# EAGLE design avr-net-pcb-rev.A (EAGLE 5.10)
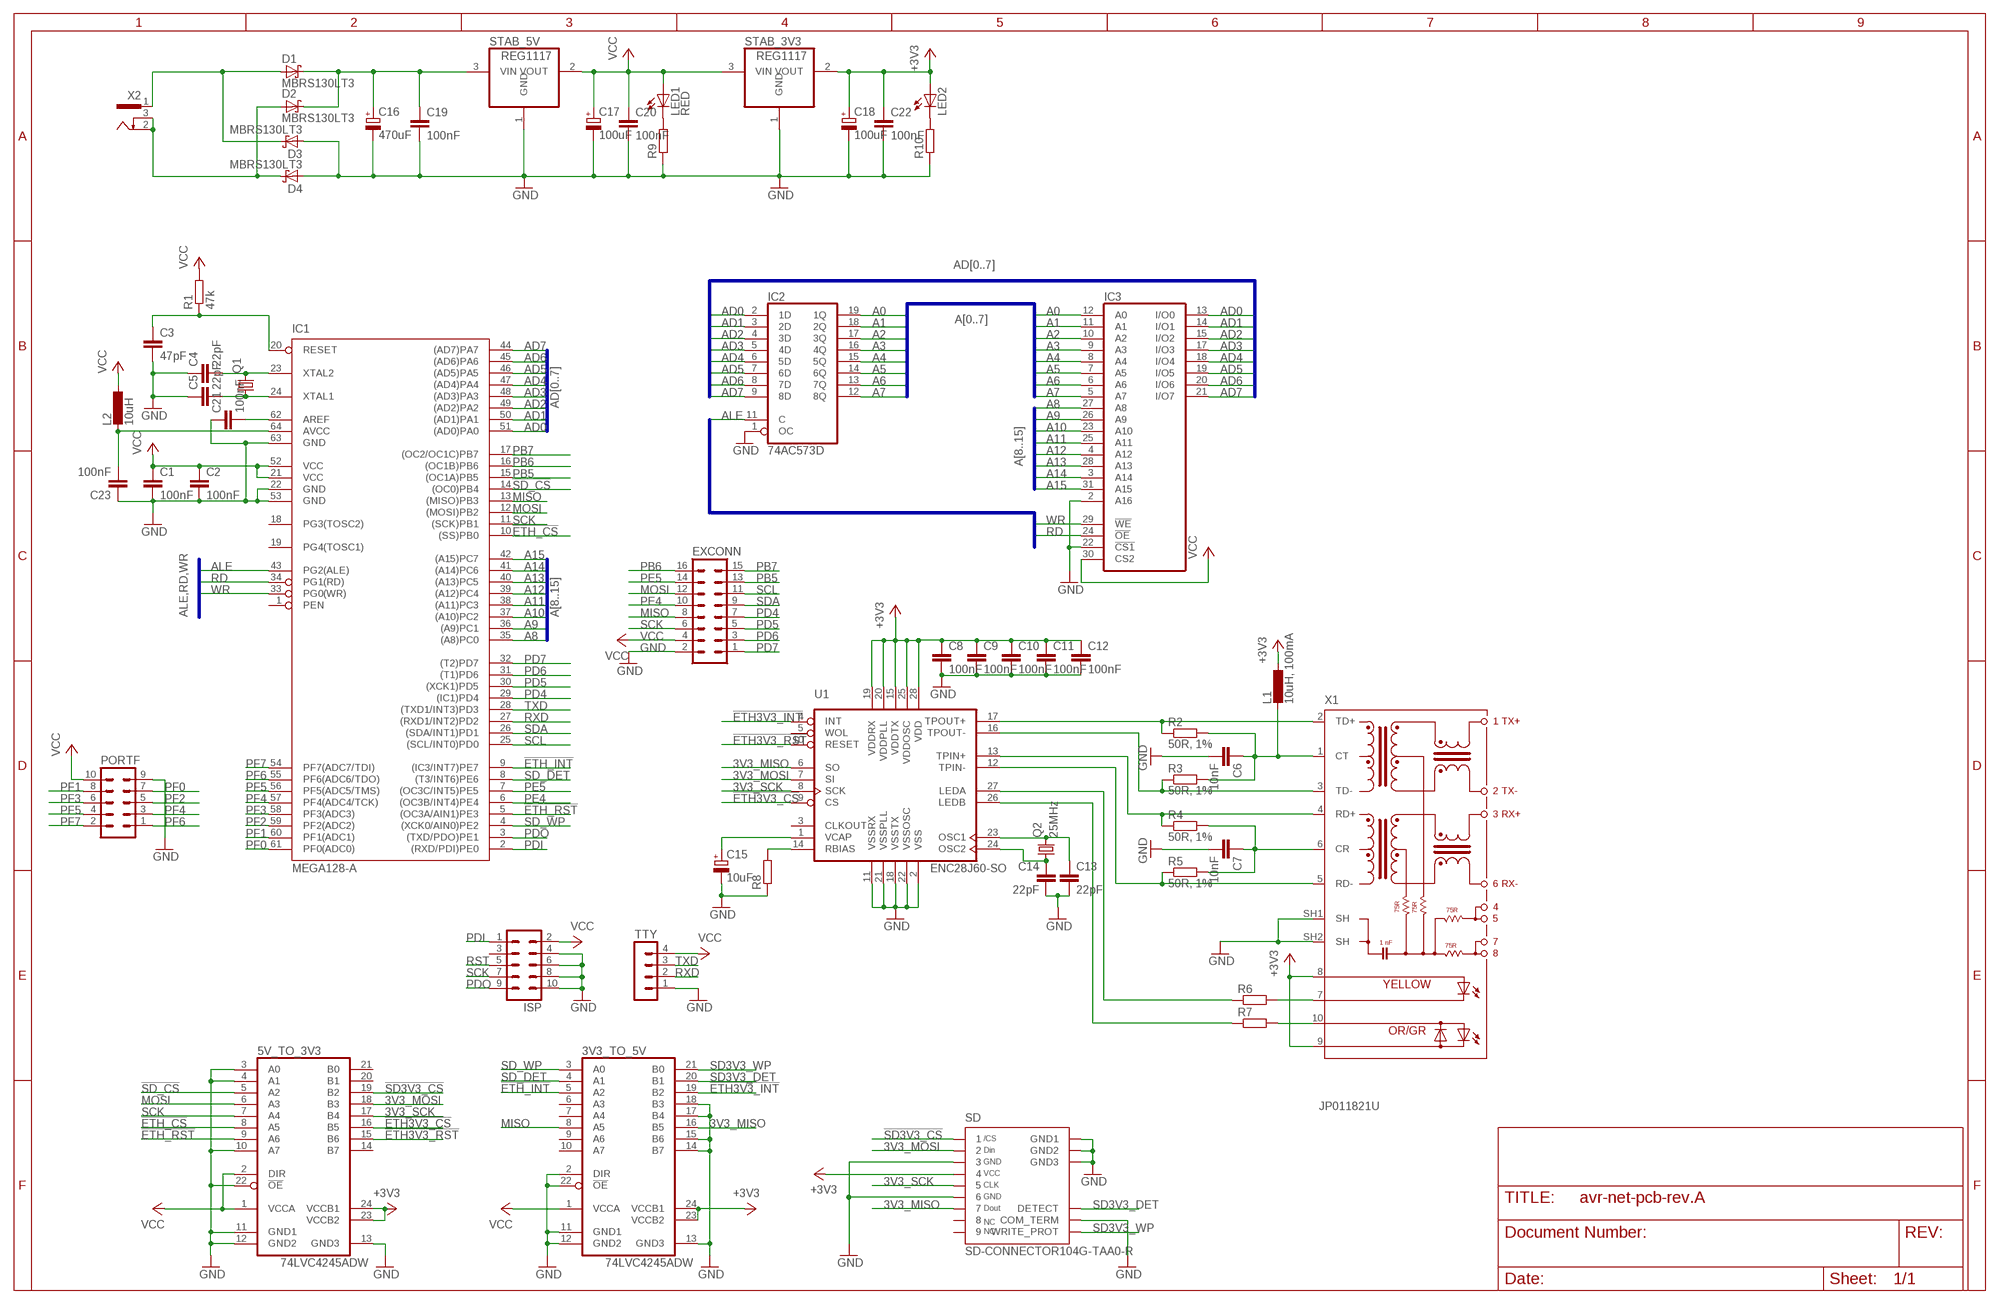
[diagram p0: schematic, sheet 1]

## Parts
3V3_TO_5V  74LVC4245ADW  [SO24W]
5V_TO_3V3  74LVC4245ADW  [SO24W]
C1  100nF  C-EUC0805  [C0805]
C2  100nF  C-EUC0805  [C0805]
C3  47pF  C-EUC0805  [C0805]
C4  22pF  C-EUC0805  [C0805]
C5  22pF  C-EUC0805  [C0805]
C6  10nF  C-EUC0805  [C0805]
C7  10nF  C-EUC0805  [C0805]
C8  100nF  C-EUC0805  [C0805]
C9  100nF  C-EUC0805  [C0805]
C10  100nF  C-EUC0805  [C0805]
C11  100nF  C-EUC0805  [C0805]
C12  100nF  C-EUC0805  [C0805]
C13  22pF  C-EUC0805  [C0805]
C14  22pF  C-EUC0805  [C0805]
C15  10uF  CPOL-EU153CLV-0505  [153CLV-0505]
C16  470uF  CPOL-EU153CLV-0810  [153CLV-0810]
C17  100uF  CPOL-EU153CLV-0810  [153CLV-0810]
C18  100uF  CPOL-EU153CLV-0810  [153CLV-0810]
C19  100nF  C-EUC0805  [C0805]
C20  100nF  C-EUC0805  [C0805]
C21  100nF  C-EUC0805  [C0805]
C22  100nF  C-EUC0805  [C0805]
C23  100nF  C-EUC0805  [C0805]
D1  MBRS130LT3  [SMB]
D2  MBRS130LT3  [SMB]
D3  MBRS130LT3  [SMB]
D4  MBRS130LT3  [SMB]
EXCONN  MA08-2  [MA08-2]
IC1  MEGA128-A  [TQFP64]
IC2  74AC573D  [SO20W]
IC3  LP621024CM  [SOP32L]
ISP  ML10  [ML10]
L1  10uH, 100mA  L-EUL1812  [L1812]
L2  10uH  L-EUL1812  [L1812]
LED1  RED  LED3MM  [LED3MM]
LED2  LED3MM  [LED3MM]
PORTF  MA05-2  [MA05-2]
Q1  CRYSTALHC49UP  [HC49UP]
Q2  25MHz  CRYSTALHC49UP  [HC49UP]
R1  47k  R-EU_R0805  [R0805]
R2  50R, 1%  R-EU_R0805  [R0805]
R3  50R, 1%  R-EU_R0805  [R0805]
R4  50R, 1%  R-EU_R0805  [R0805]
R5  50R, 1%  R-EU_R0805  [R0805]
R6  R-EU_R0805  [R0805]
R7  R-EU_R0805  [R0805]
R8  R-EU_M0805  [M0805]
R9  R-EU_R0805  [R0805]
R10  R-EU_R0805  [R0805]
SD  SD-CONNECTOR104G-TAA0-R  [104G-TAA0-R]
STAB_3V3  REG1117  [SOT223]
STAB_5V  REG1117  [SOT223]
TTY  MA04-1  [MA04-1]
U1  ENC28J60-SO  [SO28W]
X1  JP011821U  [JP]
X2  SCD-014A  [SCD-014-A]

## Nets
3V3_MISO: 3V3_TO_5V.16(B5) SD.7 U1.6(SO)
3V3_MOSI: 5V_TO_3V3.18(B3) SD.2 U1.7(SI)
3V3_SCK: 5V_TO_3V3.17(B4) SD.5 U1.8(SCK)
!ETH3V3_CS: 5V_TO_3V3.16(B5) U1.9(CS)
!ETH3V3_INT: 3V3_TO_5V.19(B2) U1.4(INT)
!ETH3V3_RST: 5V_TO_3V3.15(B6) U1.10(RESET)
!ETH_CS: 5V_TO_3V3.8(A5) IC1.10((SS)PB0)
!ETH_INT: 3V3_TO_5V.5(A2) IC1.9((IC3/INT7)PE7)
!ETH_RST: 5V_TO_3V3.9(A6) IC1.5((OC3A/AIN1)PE3)
!SD3V3_CS: 5V_TO_3V3.19(B2) SD.1
!SD_CS: 5V_TO_3V3.5(A2) IC1.14((OC0)PB4)
+3V3: 3V3_TO_5V.23(VCCB2) 3V3_TO_5V.24(VCCB1) 5V_TO_3V3.23(VCCB2) 5V_TO_3V3.24(VCCB1) C8.1 C9.1 C10.1 C11.1 C12.1 C18.+ C22.1 L1.1 LED2.A SD.4 STAB_3V3.2(VOUT) U1.15(VDDTX) U1.19(VDDRX) U1.20(VDDPLL) U1.25(VDDOSC) U1.28(VDD) X1.8(A-Y) X1.9(A-O_C-G)
A0: IC2.19(1Q) IC3.12(A0)
A1: IC2.18(2Q) IC3.11(A1)
A2: IC2.17(3Q) IC3.10(A2)
A3: IC2.16(4Q) IC3.9(A3)
A4: IC2.15(5Q) IC3.8(A4)
A5: IC2.14(6Q) IC3.7(A5)
A6: IC2.13(7Q) IC3.6(A6)
A7: IC2.12(8Q) IC3.5(A7)
A8: IC1.35((A8)PC0) IC3.27(A8)
A9: IC1.36((A9)PC1) IC3.26(A9)
A10: IC1.37((A10)PC2) IC3.23(A10)
A11: IC1.38((A11)PC3) IC3.25(A11)
A12: IC1.39((A12)PC4) IC3.4(A12)
A13: IC1.40((A13)PC5) IC3.28(A13)
A14: IC1.41((A14)PC6) IC3.3(A14)
A15: IC1.42((A15)PC7) IC3.31(A15)
AD0: IC1.51((AD0)PA0) IC2.2(1D) IC3.13(I/O0)
AD1: IC1.50((AD1)PA1) IC2.3(2D) IC3.14(I/O1)
AD2: IC1.49((AD2)PA2) IC2.4(3D) IC3.15(I/O2)
AD3: IC1.48((AD3)PA3) IC2.5(4D) IC3.17(I/O3)
AD4: IC1.47((AD4)PA4) IC2.6(5D) IC3.18(I/O4)
AD5: IC1.46((AD5)PA5) IC2.7(6D) IC3.19(I/O5)
AD6: IC1.45((AD6)PA6) IC2.8(7D) IC3.20(I/O6)
AD7: IC1.44((AD7)PA7) IC2.9(8D) IC3.21(I/O7)
ALE: IC1.43(PG2(ALE)) IC2.11(C)
GND: 3V3_TO_5V.2(DIR) 3V3_TO_5V.11(GND1) 3V3_TO_5V.12(GND2) 3V3_TO_5V.13(GND3) 3V3_TO_5V.14(B7) 3V3_TO_5V.15(B6) 3V3_TO_5V.17(B4) 3V3_TO_5V.18(B3) 3V3_TO_5V.22(!OE) 5V_TO_3V3.3(A0) 5V_TO_3V3.4(A1) 5V_TO_3V3.10(A7) 5V_TO_3V3.11(GND1) 5V_TO_3V3.12(GND2) 5V_TO_3V3.13(GND3) 5V_TO_3V3.22(!OE) C1.2 C2.2 C3.2 C4.1 C5.1 C6.2 C7.2 C8.2 C9.2 C10.2 C11.2 C12.2 C13.2 C14.2 C15.- C16.- C17.- C18.- C19.2 C20.2 C21.1 C22.2 C23.1 D3.A D4.A EXCONN.2 IC1.22(GND) IC1.53(GND) IC1.63(GND) IC2.1(OC) IC3.2(A16) IC3.22(!CS1) ISP.4 ISP.6 ISP.8 ISP.10 PORTF.9 R8.1 R9.1 R10.1 SD.3 SD.6 SD.COMMON(COM_TERM) SD.GND1 SD.GND2 SD.GND3 STAB_3V3.1(GND) STAB_5V.1(GND) TTY.1 U1.2(VSS) U1.11(VSSRX) U1.18(VSSTX) U1.21(VSSPLL) U1.22(VSSOSC) X1.SH1(SH) X1.SH2(SH)
MISO: 3V3_TO_5V.8(A5) EXCONN.8 IC1.13((MISO)PB3)
MOSI: 5V_TO_3V3.6(A3) EXCONN.12 IC1.12((MOSI)PB2)
N$1: C4.2 IC1.23(XTAL2) Q1.2
N$2: C5.2 IC1.24(XTAL1) Q1.1
N$3: R7.2 X1.10(C-O_A-G)
N$4: C6.1 L1.2 R2.2 R3.2 X1.1(CT)
N$5: R2.1 U1.17(TPOUT+) X1.2(TD+)
N$6: R3.1 U1.16(TPOUT-) X1.3(TD-)
N$7: R4.1 U1.13(TPIN+) X1.4(RD+)
N$8: R5.1 U1.12(TPIN-) X1.5(RD-)
N$9: C7.1 R4.2 R5.2 X1.6(CR)
N$10: R6.1 U1.27(LEDA)
N$11: R7.1 U1.26(LEDB)
N$12: R6.2 X1.7(C-Y)
N$16: C13.1 Q2.2 U1.23(OSC1)
N$17: C14.1 Q2.1 U1.24(OSC2)
N$20: R8.2 U1.14(RBIAS)
N$21: C15.+ U1.1(VCAP)
N$31: D1.A D3.C X2.1
N$32: C21.2 IC1.62(AREF)
N$33: D2.A D4.C X2.2 X2.3
N$34: C16.+ C19.1 D1.C D2.C STAB_5V.3(VIN)
N$35: C23.2 IC1.64(AVCC) L2.2
N$36: LED1.K(C) R9.2
N$37: LED2.K(C) R10.2
PB5: EXCONN.13 IC1.15((OC1A)PB5)
PB6: EXCONN.16 IC1.16((OC1B)PB6)
PB7: EXCONN.15 IC1.17((OC2/OC1C)PB7)
PD4: EXCONN.7 IC1.29((IC1)PD4)
PD5: EXCONN.5 IC1.30((XCK1)PD5)
PD6: EXCONN.3 IC1.31((T1)PD6)
PD7: EXCONN.1 IC1.32((T2)PD7)
PDI: IC1.2((RXD/PDI)PE0) ISP.1
PDO: IC1.3((TXD/PDO)PE1) ISP.9
PE4: EXCONN.10 IC1.6((OC3B/INT4)PE4)
PE5: EXCONN.14 IC1.7((OC3C/INT5)PE5)
PF0: IC1.61(PF0(ADC0)) PORTF.7
PF1: IC1.60(PF1(ADC1)) PORTF.8
PF2: IC1.59(PF2(ADC2)) PORTF.5
PF3: IC1.58(PF3(ADC3)) PORTF.6
PF4: IC1.57(PF4(ADC4/TCK)) PORTF.3
PF5: IC1.56(PF5(ADC5/TMS)) PORTF.4
PF6: IC1.55(PF6(ADC6/TDO)) PORTF.1
PF7: IC1.54(PF7(ADC7/TDI)) PORTF.2
RD: IC1.34(PG1(RD)) IC3.24(!OE)
RST: C3.1 IC1.20(RESET) ISP.5 R1.1
RXD: IC1.27((RXD1/INT2)PD2) TTY.2
SCK: 5V_TO_3V3.7(A4) EXCONN.6 IC1.11((SCK)PB1) ISP.7
SCL: EXCONN.11 IC1.25((SCL/INT0)PD0)
SD3V3_DET: 3V3_TO_5V.20(B1) SD.CD(DETECT)
SD3V3_WP: 3V3_TO_5V.21(B0) SD.WRITE_PROTECT(WRITE_PROT)
SD_DET: 3V3_TO_5V.4(A1) IC1.8((T3/INT6)PE6)
SD_WP: 3V3_TO_5V.3(A0) IC1.4((XCK0/AIN0)PE2)
SDA: EXCONN.9 IC1.26((SDA/INT1)PD1)
TXD: IC1.28((TXD1/INT3)PD3) TTY.3
VCC: 3V3_TO_5V.1(VCCA) 5V_TO_3V3.1(VCCA) 5V_TO_3V3.2(DIR) C1.1 C2.1 C17.+ C20.1 EXCONN.4 IC1.21(VCC) IC1.52(VCC) IC3.30(CS2) ISP.2 L2.1 LED1.A PORTF.10 R1.2 STAB_3V3.3(VIN) STAB_5V.2(VOUT) TTY.4
WR: IC1.33(PG0(WR)) IC3.29(!WE)
Unconnected: 3V3_TO_5V.6(A3) 3V3_TO_5V.7(A4) 3V3_TO_5V.9(A6) 3V3_TO_5V.10(A7) 5V_TO_3V3.14(B7) 5V_TO_3V3.20(B1) 5V_TO_3V3.21(B0) IC1.1(PEN) IC1.18(PG3(TOSC2)) IC1.19(PG4(TOSC1)) IC3.1(NC) ISP.3 SD.8 SD.9 U1.3(CLKOUT) U1.5(WOL)

## Buses
ALE,RD,WR
AD[0..7]
A[8..15]
A[0..7]

## Power pins joined to a net without a drawn wire
GND: IC2.10(GND) IC3.16(GND)
VCC: IC2.20(VCC) IC3.32(VCC)

## Library data of the parts
3V3_TO_5V 5V_TO_3V3 = 74LVCxx:74LVC4245: Octal dual supply translating transceiver; 3-state The 74LVC4245A is an octal dual supply translating transceiver featuring non-inverting 3-state bus compatible outputs in both send and receive directions. It is designed to interface between a 3 V and 5 V bus in a mixed 3 V and 5 V supply environment.
C1-C14 C19-C23 = rcl:C-EU: CAPACITOR, European symbol
C15-C18 = rcl:CPOL-EU: POLARIZED CAPACITOR, European symbol
D1-D4 = diode:MBRS130LT3: Schottky Power Rectifier Source: http://www.onsemi.com/pub/Collateral/MBRS130LT3-D.PDF
EXCONN = con-lstb:MA08-2: PIN HEADER
IC1 = atmel:MEGA128: MICROCONTROLLER 128 Kbytes FLASH 4 Kbytes SRAM 4 Kbytes EEPROM DUAL USART 8-channel 10 bit ADC Source: avr.lbr
IC2 = 74xx-eu:74*573: 8-bit D latch BUS DRIVER
IC3 = memory:LP621024CM: MEMORY
ISP = con-harting-ml:ML10: HARTING
L1 L2 = rcl:L-EU: INDUCTOR, European symbol
LED1 LED2 = led:LED: LED OSRAM: - CHIPLED LG R971, LG N971, LY N971, LG Q971, LY Q971, LO R971, LY R971 LH N974, LH R974 LS Q976, LO Q976, LY Q976 LO Q996 - Hyper CHIPLED LW Q18S LB Q993, LB Q99A, LB R99A - SideLED LS A670, LO A670, LY A670, LG A670, LP A670 LB A673, LV A673, LT A673, LW A673 LH A674 LY A675 LS A676, LA A676, LO A676, LY A676, LW A676 LS A679, LY A679, LG A679 - Hyper Micro SIDELED® LS Y876, LA Y876, LO Y876, LY Y876 LT Y87S - SmartLED LW L88C, LW L88S LB L89C, LB L89S, LG L890 LS L89K, LO L89K, LY L89K LS L896, LA L896, LO L896, LY L896 - TOPLED LS T670, LO T670, LY T670, LG T670, LP T670 LSG T670, LSP T670, LSY T670, LOP T670, LYG T670 LG T671, LOG T671, LSG T671 LB T673, LV T673, LT T673, LW T673 LH T674 LS T676, LA T676, LO T676, LY T676, LB T676, LH T676, LSB T676, LW T676 LB T67C, LV T67C, LT T67C, LS T67K, LO T67K, LY T67K, LW E67C LS E67B, LA E67B, LO E67B, LY E67B, LB E67C, LV E67C, LT E67C LW T67C LS T679, LY T679, LG T679 LS T770, LO T770, LY T770, LG T770, LP T770 LB T773, LV T773, LT T773, LW T773 LH T774 LS E675, LA E675, LY E675, LS T675 LS T776, LA T776, LO T776, LY T776, LB T776 LHGB T686 LT T68C, LB T68C - Hyper Mini TOPLED® LB M676 - Mini TOPLED Santana® LG M470 LS M47K, LO M47K, LY M47K Source: http://www.osram.convergy.de LUXEON: - LUMILED® LXK2-PW12-R00, LXK2-PW12-S00, LXK2-PW14-U00, LXK2-PW14-V00 LXK2-PM12-R00, LXK2-PM12-S00, LXK2-PM14-U00 LXK2-PE12-Q00, LXK2-PE12-R00, LXK2-PE12-S00, LXK2-PE14-T00, LXK2-PE14-U00 LXK2-PB12-K00, LXK2-PB12-L00, LXK2-PB12-M00, LXK2-PB14-N00, LXK2-PB14-P00, LXK2-PB14-Q00 LXK2-PR12-L00, LXK2-PR12-M00, LXK2-PR14-Q00, LXK2-PR14-R00 LXK2-PD12-Q00, LXK2-PD12-R00, LXK2-PD12-S00 LXK2-PH12-R00, LXK2-PH12-S00 LXK2-PL12-P00, LXK2-PL12-Q00, LXK2-PL12-R00 Source: www.luxeon.com KINGBRIGHT: KA-3528ASYC Source: www.kingbright.com
PORTF = con-lstb:MA05-2: PIN HEADER
Q1 Q2 = crystal:CRYSTAL: CRYSTAL
R1-R10 = rcl:R-EU_: RESISTOR, European symbol
SD = con-sd-attend:SD-CONNECTOR
STAB_3V3 STAB_5V = burr-brown:REG1117: 800mA and 1A Low Dropout (LDO) Positive Regulator 1.8V, 2.5V, 2.85V, 3.3V, 5V, and Adj
TTY = con-lstb:MA04-1: PIN HEADER
U1 = microchip-enc28j60:ENC28J60-*: Microchip 10Mbit Eth. contoller with SPI interface
X1 = con-pulse:JP011821U: PULSEJACK (TM) 1x1 Tab-UP RJ45 10/100 Base-TX RJ45 1x1 Tab-UP with LEDs 8-pin (J1 series) and 6-pin (JP series) integrated magnetics connector, designed to support applications, such as ADSL modems, LAN-on-Motherboard, and Hub and Switches. Source: www.pulseeng.com .. PulseJack-J402.pdf
X2 = con-shiua-chyuan:SCD-014A: Power Jack 2.5mm

## Net classes
0 default: width 0.305 mm, drill 0.305 mm, clearance 0.305 mm
1 PWR: width 0.406 mm, drill 0.406 mm, clearance 0.406 mm

## Board
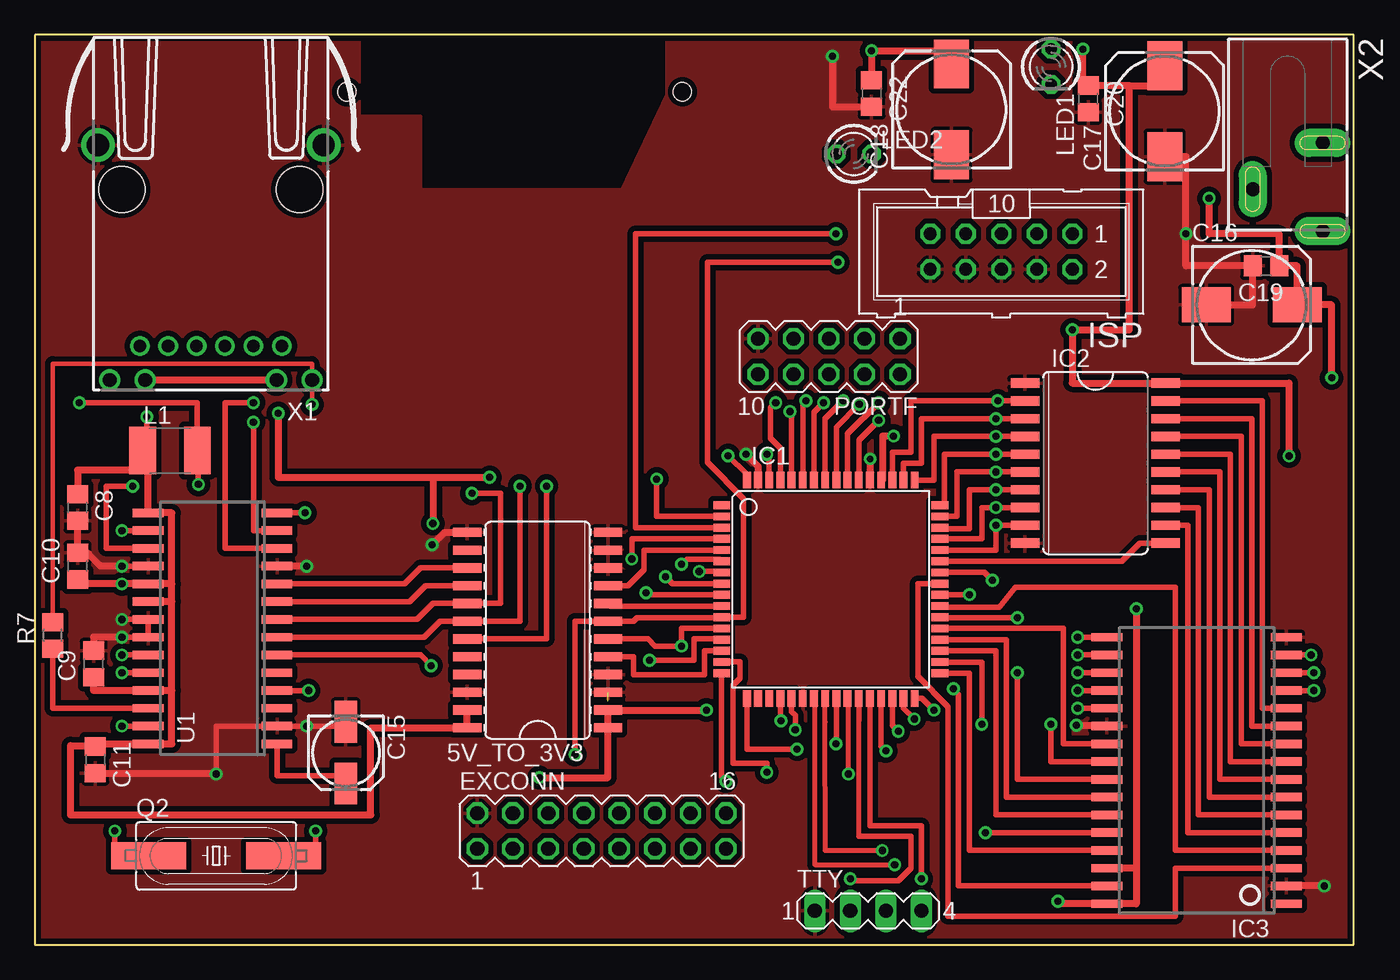
[diagram p1: board, top side]
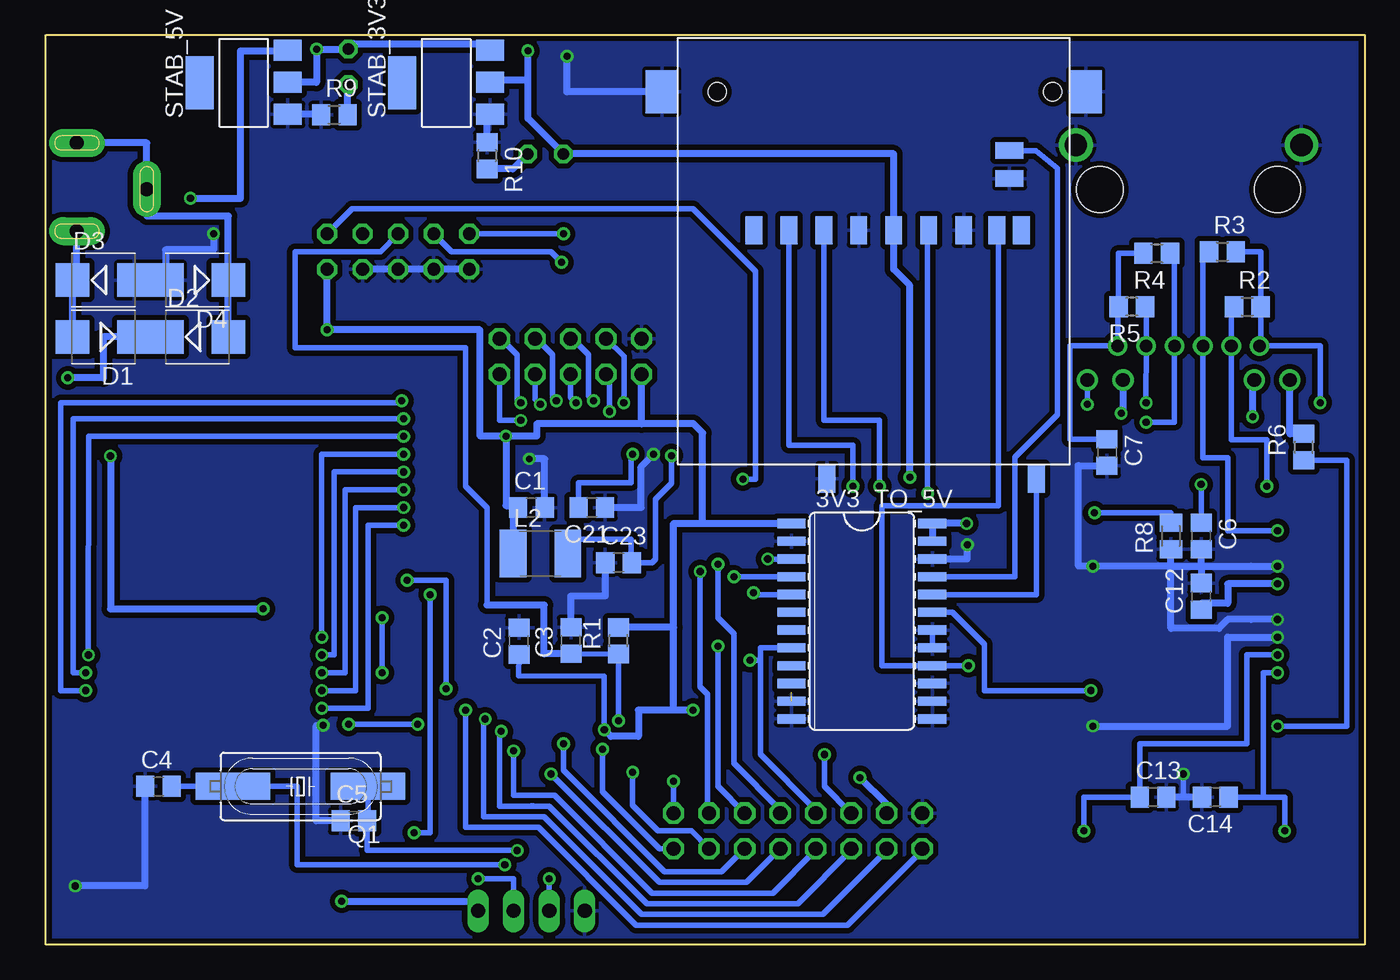
[diagram p2: board, bottom side, seen from below]

Size 94.28 x 65.01 mm. Coordinates in mm from the lower left corner, seen from the top.
Outline: 0,0 94.28,0 94.28,65.01 0,65.01 0,0
Copper layers (1*16): Top 0.035mm / dielectric 1.5mm / Bottom 0.035mm
Design rules "default *": minimum track width 10mil, minimum drill 20mil, track to track 8mil, track to pad 8mil, pad to pad 8mil, via to via 8mil, smd to smd 8mil, copper to edge 5mil, drill to drill 8mil, minimum pad ring 10mil, minimum via ring 8mil, stop-mask expansion 4mil, vias tented up to drill 0mil, thermal gap 10mil

### Footprints (pad centres in the part's own frame; a part is rotated, then mirrored left to right if it is on the bottom)
SO24W = smd 0.66 x 2.032: 1 -6.731,-5.029; 2 -5.461,-5.029; 3 -4.191,-5.029; 4 -2.921,-5.029; 5 -1.651,-5.029; 6 -0.381,-5.029; 7 0.889,-5.029; 8 2.159,-5.029; 9 3.429,-5.029; 10 4.699,-5.029; 11 5.969,-5.029; 12 7.239,-5.029; 13 7.239,5.029; 14 5.969,5.029; 15 4.699,5.029; 16 3.429,5.029; 17 2.159,5.029; 18 0.889,5.029; 19 -0.381,5.029; 20 -1.651,5.029; 21 -2.921,5.029; 22 -4.191,5.029; 23 -5.461,5.029; 24 -6.731,5.029
C0805 = smd 1.3 x 1.5: 1 -0.95,0; 2 0.95,0
153CLV-0505 = smd 3 x 1.6: + 2.2,0; - -2.2,0
153CLV-0810 = smd 3.5 x 2.5: + 3.25,0; - -3.25,0
SMB = smd 2.4 x 2.4: A 2.2,0; C -2.2,0
MA08-2 = drill 1.016 octagon: 1 -8.89,-1.27; 2 -8.89,1.27; 3 -6.35,-1.27; 4 -6.35,1.27; 5 -3.81,-1.27; 6 -3.81,1.27; 7 -1.27,-1.27; 8 -1.27,1.27; 9 1.27,-1.27; 10 1.27,1.27; 11 3.81,-1.27; 12 3.81,1.27; 13 6.35,-1.27; 14 6.35,1.27; 15 8.89,-1.27; 16 8.89,1.27
TQFP64 = smd 1.194 x 0.559: 1 -7.8,6; 2 -7.8,5.2; 3 -7.8,4.4; 4 -7.8,3.6; 5 -7.8,2.8; 6 -7.8,2; 7 -7.8,1.2; 8 -7.8,0.4; 9 -7.8,-0.4; 10 -7.8,-1.2; 11 -7.8,-2; 12 -7.8,-2.8; 13 -7.8,-3.6; 14 -7.8,-4.4; 15 -7.8,-5.2; 16 -7.8,-6; 33 7.8,-6; 34 7.8,-5.2; 35 7.8,-4.4; 36 7.8,-3.6; 37 7.8,-2.8; 38 7.8,-2; 39 7.8,-1.2; 40 7.8,-0.4; 41 7.8,0.4; 42 7.8,1.2; 43 7.8,2; 44 7.8,2.8; 45 7.8,3.6; 46 7.8,4.4; 47 7.8,5.2; 48 7.8,6 | smd 0.559 x 1.194: 17 -6,-7.8; 18 -5.2,-7.8; 19 -4.4,-7.8; 20 -3.6,-7.8; 21 -2.8,-7.8; 22 -2,-7.8; 23 -1.2,-7.8; 24 -0.4,-7.8; 25 0.4,-7.8; 26 1.2,-7.8; 27 2,-7.8; 28 2.8,-7.8; 29 3.6,-7.8; 30 4.4,-7.8; 31 5.2,-7.8; 32 6,-7.8; 49 6,7.8; 50 5.2,7.8; 51 4.4,7.8; 52 3.6,7.8; 53 2.8,7.8; 54 2,7.8; 55 1.2,7.8; 56 0.4,7.8; 57 -0.4,7.8; 58 -1.2,7.8; 59 -2,7.8; 60 -2.8,7.8; 61 -3.6,7.8; 62 -4.4,7.8; 63 -5.2,7.8; 64 -6,7.8
SO20W = smd 0.66 x 2.032: 1 -5.715,-5.029; 2 -4.445,-5.029; 3 -3.175,-5.029; 4 -1.905,-5.029; 5 -0.635,-5.029; 6 0.635,-5.029; 7 1.905,-5.029; 8 3.175,-5.029; 9 4.445,-5.029; 10 5.715,-5.029; 11 5.715,5.029; 12 4.445,5.029; 13 3.175,5.029; 14 1.905,5.029; 15 0.635,5.029; 16 -0.635,5.029; 17 -1.905,5.029; 18 -3.175,5.029; 19 -4.445,5.029; 20 -5.715,5.029
SOP32L = smd 0.6 x 2.2: 1 -9.525,-6.416; 2 -8.255,-6.416; 3 -6.985,-6.416; 4 -5.715,-6.416; 5 -4.445,-6.416; 6 -3.175,-6.416; 7 -1.905,-6.416; 8 -0.635,-6.416; 9 0.635,-6.416; 10 1.905,-6.416; 11 3.175,-6.416; 12 4.445,-6.416; 13 5.715,-6.416; 14 6.985,-6.416; 15 8.255,-6.416; 16 9.525,-6.416; 17 9.525,6.416; 18 8.255,6.416; 19 6.985,6.416; 20 5.715,6.416; 21 4.445,6.416; 22 3.175,6.416; 23 1.905,6.416; 24 0.635,6.416; 25 -0.635,6.416; 26 -1.905,6.416; 27 -3.175,6.416; 28 -4.445,6.416; 29 -5.715,6.416; 30 -6.985,6.416; 31 -8.255,6.416; 32 -9.525,6.416
ML10 = drill 0.914 octagon: 1 -5.08,-1.27; 2 -5.08,1.27; 3 -2.54,-1.27; 4 -2.54,1.27; 5 0,-1.27; 6 0,1.27; 7 2.54,-1.27; 8 2.54,1.27; 9 5.08,-1.27; 10 5.08,1.27
L1812 = smd 1.9 x 3.4: 1 -1.95,0; 2 1.95,0
LED3MM = drill 0.813 octagon: A -1.27,0; K 1.27,0
MA05-2 = drill 1.016 octagon: 1 -5.08,-1.27; 2 -5.08,1.27; 3 -2.54,-1.27; 4 -2.54,1.27; 5 0,-1.27; 6 0,1.27; 7 2.54,-1.27; 8 2.54,1.27; 9 5.08,-1.27; 10 5.08,1.27
HC49UP = smd 5.334 x 1.93: 1 -4.826,0; 2 4.826,0
R0805 = smd 1.3 x 1.5: 1 -0.95,0; 2 0.95,0
M0805 = smd 1.3 x 1.6: 1 -0.95,0; 2 0.95,0
104G-TAA0-R = smd 1.2 x 2: 1 6.87,0; 2 4.37,0; 3 1.87,0; 4 -0.63,0; 5 -3.13,0; 6 -5.63,0; 7 -8,0; 8 -9.75,0; 9 9.37,0; CD -10.83,17.75; GND2 4.15,17.75 | smd 2 x 1.2: COMMON -8.9,-3.7; WRITE_PROTECT -8.9,-5.7 | smd 2.3 x 3.1: GND1 -14.35,-9.9; GND3 15.95,-9.9 | hole 1.3: -12,-9.9; 12,-9.9
SOT223 = smd 1.499 x 2.007: 1 -2.261,-3.15; 2 0.025,-3.15; 3 2.311,-3.15 | smd 3.81 x 2.007: 4 0,3.15
MA04-1 = drill 1.016 long: 1 -3.81,0; 2 -1.27,0; 3 1.27,0; 4 3.81,0
SO28W = smd 0.6 x 2.2: 1 -8.255,-4.6; 2 -6.985,-4.6; 3 -5.715,-4.6; 4 -4.445,-4.6; 5 -3.175,-4.6; 6 -1.905,-4.6; 7 -0.635,-4.6; 8 0.635,-4.6; 9 1.905,-4.6; 10 3.175,-4.6; 11 4.445,-4.6; 12 5.715,-4.6; 13 6.985,-4.6; 14 8.255,-4.6; 15 8.255,4.6; 16 6.985,4.6; 17 5.715,4.6; 18 4.445,4.6; 19 3.175,4.6; 20 1.905,4.6; 21 0.635,4.6; 22 -0.635,4.6; 23 -1.905,4.6; 24 -3.175,4.6; 25 -4.445,4.6; 26 -5.715,4.6; 27 -6.985,4.6; 28 -8.255,4.6
JP = drill 0.9 pad 1.3 round: 1 5.075,11.18; 2 3.045,11.18; 3 1.015,11.18; 4 -1.015,11.18; 5 -3.045,11.18; 6 -5.075,11.18 | drill 1 pad 1.4 round: 7 7.23,13.62; 8 4.69,13.62; 9 -4.69,13.62; 10 -7.23,13.62 | drill 1.6 pad 2.184 round: SH1 -8.065,-3.17; SH2 8.065,-3.17 | hole 3.3: 6.35,0; -6.35,0
SCD-014-A = drill 1 pad 2 long: 1 -2.5,13.8; 2 -2.5,7.5; 3 2.5,10.8

### Placement (x,y rotation side)
3V3_TO_5V  35.94,23.37 270 bottom
5V_TO_3V3  35.94,22.23 90 top
C1  59.56,31.24 0 bottom
C2  60.45,21.69 90 bottom
C3  56.74,21.74 90 bottom
C4  86.23,11.3 0 bottom
C5  72.26,8.84 0 bottom
C6  11.68,29.21 270 bottom
C7  18.41,35.18 270 bottom
C8  3.05,31.24 270 top
C9  4.19,20.07 90 top
C10  3.05,27.05 90 top
C11  4.32,13.21 270 top
C12  11.68,24.89 90 bottom
C13  15.11,10.54 0 bottom
C14  10.67,10.54 180 bottom
C15  22.23,13.72 270 top
C16  87,45.72 0 top
C17  80.77,59.56 90 top
C18  65.53,59.69 90 top
C19  88.01,48.51 180 top
C20  75.31,60.45 270 top
C21  55.24,31.24 180 bottom
C22  59.82,60.83 270 top
C23  53.34,27.3 0 bottom
D1  90.17,43.43 180 bottom
D2  83.44,43.43 0 bottom
D3  90.17,47.5 0 bottom
D4  83.44,47.5 180 bottom
EXCONN  40.51,8.13 0 top
IC1  56.9,25.4 0 top
IC2  75.82,34.42 270 top
IC3  83.06,12.45 90 top
ISP  69.09,49.53 180 top
L1  9.65,35.31 0 top
L2  58.93,27.94 0 bottom
LED1  72.64,62.74 270 top
LED2  58.55,56.52 0 top
PORTF  56.77,42.04 180 top
Q1  76.07,11.3 180 bottom
Q2  12.95,6.35 0 top
R1  53.34,21.72 90 bottom
R2  8.38,45.59 0 bottom
R3  10.16,49.53 0 bottom
R4  14.86,49.4 180 bottom
R5  16.64,45.59 180 bottom
R6  4.34,35.56 90 bottom
R7  1.27,22.1 90 top
R8  13.84,29.21 90 bottom
R9  73.66,59.31 0 bottom
R10  62.74,56.39 270 bottom
SD  34.29,51.05 180 bottom
STAB_3V3  65.66,61.59 90 bottom
STAB_5V  80.14,61.59 90 bottom
TTY  59.56,2.41 0 top
U1  12.7,22.61 90 top
X1  12.57,53.98 180 top
X2  89.56,64.8 180 top

### Tracks (layer width: path | path; a pad name or v marks a point on that pad's centre or on a via)
3V3_MISO  (via drill 0.51 pad 0.41)
  Top 0.406: U1.6 27.56,20.7 v28.32,19.94
  Bottom 0.406: v28.32,19.94 30.35,19.94 3V3_TO_5V.16 34.52,19.94 34.52,31.37 26.16,31.37 26.16,50.93
  Bottom 0.508: 26.16,50.93 SD.7
3V3_MOSI  (via drill 0.51)
  Top 0.406: v34.67,32.77 34.67,23.11 5V_TO_3V3.18 28.96,23.11 27.81,21.97 U1.7
  Bottom 0.406: SD.2 38.66,37.47 34.67,37.47 v34.67,32.77
3V3_SCK  (via drill 0.51)
  Top 0.406: v31.24,32.26 33.27,32.26 33.27,24.38 5V_TO_3V3.17 28.45,24.38 27.3,23.24 U1.8
  Bottom 0.406: v31.24,32.26 31.24,50.97
  Bottom 0.508: 31.24,50.97 SD.5
!ETH3V3_CS
  Top 0.406: U1.9 26.8,24.51 27.94,25.65 5V_TO_3V3.16
!ETH3V3_INT  (via drill 0.51 pad 0.41)
  Top 0.305: 17.53,18.29 17.4,18.16 U1.4
  Top 0.406: 17.53,18.29 17.65,18.16 v19.56,18.16
  Bottom 0.406: v19.56,18.16 27.18,18.16 27.18,21.46 29.46,23.75 3V3_TO_5V.19
!ETH3V3_RST
  Top 0.406: U1.10 26.42,25.78 27.56,26.92 5V_TO_3V3.15
!ETH_CS
  Top 0.406: IC1.10 41.15,24.2 5V_TO_3V3.8
!ETH_INT  (via drill 0.51 pad 0.41)
  Top 0.406: IC1.9 43.83,25 v43.69,25.15
  Bottom 0.406: 3V3_TO_5V.5 43.56,25.02 arc90 v43.69,25.15
!ETH_RST
  Top 0.406: 5V_TO_3V3.9 42.42,25.65 43.56,26.8 43.56,28.2 IC1.5
!SD3V3_CS  (via drill 0.51)
  Top 0.406: v36.58,32.77 36.58,21.84 5V_TO_3V3.19
  Bottom 0.406: SD.1 41.16,35.69 36.58,35.69 v36.58,32.77
!SD_CS
  Top 0.406: IC1.14 47.88,21 47.88,19.3 42.8,19.3 42.8,20.57 5V_TO_3V3.5
+3V3  (via drill 0.51)
  Top 0.406: 8.1,34.16 L1.1 8,36.07 v8,37.72
  Top 0.508: 9.78,24.51 9.78,25.78 | 9.78,24.51 U1.20 | 9.78,18.16 9.78,14.35 U1.28 4,14.35 C11.1 4.32,14.22 2.54,14.22 2.54,9.27 24,9.27 24,15.49 5V_TO_3V3.24 5V_TO_3V3.23 | 9.78,18.16 U1.25 4.19,18.16 C9.1 | 9.78,18.16 9.78,24.51 | 9.78,25.78 U1.19 v6.22,25.78 3.05,25.78 C10.1 | 9.78,25.78 9.78,30.86 U1.15 | U1.15 8.1,34.16 | X1.8 X1.9 | U1.15 8.1,33.91 3.05,33.91 C8.1 | C22.1 v59.82,63.88 65.53,63.88 C18.+ | 28.45,33.4 v32.51,33.4 | 28.45,33.4 v28.45,30.1 | v17.4,37.97 17.4,33.4 28.45,33.4
  Bottom 0.406: 8,40.24 X1.8
  Bottom 0.508: v8,37.72 8,40.24 | C12.1 11.68,24.38 9.78,24.38 9.78,25.78 v6.22,25.78 | C22.1 59.82,59.05 LED2.A 33.66,56.52 SD.4 33.66,48.26 32.51,47.12 v32.51,33.4 | C22.1 v59.82,63.88 | X1.9 17.26,38.11 v17.4,37.97 | v28.45,30.1 3V3_TO_5V.24 3V3_TO_5V.23 | STAB_3V3.2 62.51,61.78 C22.1
A0
  Top 0.406: IC2.19 87.76,38.86 87.76,16.89 IC3.12
A1
  Top 0.406: IC2.18 87,37.59 87,15.62 IC3.11
A2
  Top 0.406: IC2.17 86.23,36.32 86.23,14.35 IC3.10
A3
  Top 0.406: IC2.16 85.47,35.05 85.47,13.08 IC3.9
A4
  Top 0.406: IC2.15 84.71,33.78 84.71,11.81 IC3.8
A5
  Top 0.406: IC2.14 83.95,32.51 83.95,10.54 IC3.7
A6
  Top 0.406: IC2.13 83.19,31.24 83.19,9.27 IC3.6
A7
  Top 0.406: IC2.12 82.42,29.97 82.42,8 IC3.5
A8
  Top 0.406: IC1.35 68.71,21 68.71,9.27 IC3.27
A9
  Top 0.406: IC1.36 69.47,21.8 69.47,10.54 IC3.26
A10
  Top 0.406: IC3.23 73.53,14.35 73.53,22.61 IC1.37
A11  (via drill 0.51)
  Top 0.406: IC3.25 70.23,11.81 v70.23,19.43 | v70.23,23.37 64.7,23.37 IC1.38
  Bottom 0.406: v70.23,19.43 v70.23,23.37
A12
  Top 0.406: IC3.4 81.53,6.73 81.53,25.53 70.1,25.53 68.96,24.13 64.82,24.13 64.7,24.26 IC1.39
A13  (via drill 0.51)
  Top 0.406: v67.94,8 IC3.28 | v66.8,25.02 64.7,25.02 IC1.40
  Bottom 0.406: v67.94,8 66.8,8 v66.8,25.02
A14
  Top 0.406: IC1.41 63.12,25.8 63.12,19.18 65.28,17.02 65.28,2.03 81.53,2.03 81.53,5.46 IC3.3
A15  (via drill 0.51)
  Top 0.406: IC3.31 66.04,4.19 66.04,17.91 v65.66,18.29 | 64.7,26.67 IC1.42 67.89,26.6 v68.45,26.04
  Bottom 0.406: v65.66,18.29 65.66,26.04 v68.45,26.04
AD0  (via drill 0.51)
  Top 0.406: v91.44,18.16 IC3.13 | IC2.2 v68.83,38.86 62.61,38.86 62.61,35.18 61.3,35.18 IC1.51
  Bottom 0.406: v91.44,18.16 93.22,18.16 93.22,38.73 68.83,38.73 v68.83,38.86
AD1  (via drill 0.51)
  Top 0.406: v91.44,19.43 IC3.14 | IC2.3 v68.71,37.59 63.37,37.59 63.37,34.42 62.1,34.42 IC1.50
  Bottom 0.406: v91.44,19.43 92.33,19.43 92.33,37.59 v68.71,37.59
AD2  (via drill 0.51)
  Top 0.406: v91.24,20.7 IC3.15 | IC2.4 v68.71,36.32 64.26,36.32 64.26,33.2 IC1.49
  Bottom 0.406: v91.24,20.7 91.21,36.35 v68.71,36.32
AD3  (via drill 0.51)
  Top 0.406: v74.55,21.97 IC3.17 | IC2.5 v68.71,35.05 65.02,35.05 65.02,31.37 64.73,31.37 IC1.48
  Bottom 0.406: v74.55,21.97 74.55,35.05 v68.71,35.05
AD4  (via drill 0.51)
  Top 0.406: IC3.18 76.64,20.57 76.52,20.7 v74.55,20.7 | IC2.6 v68.71,33.78 65.91,33.78 65.91,30.61 IC1.47
  Bottom 0.406: v68.71,33.78 73.66,33.78 73.66,20.7 v74.55,20.7
AD5  (via drill 0.51)
  Top 0.406: v74.55,19.43 IC3.19 | IC2.7 v68.71,32.51 66.8,32.51 66.8,29.72 64.78,29.72 IC1.46
  Bottom 0.406: v74.55,19.43 72.9,19.43 72.9,32.51 v68.71,32.51
AD6  (via drill 0.51)
  Top 0.406: 71.37,31.24 IC2.8 v68.71,31.24 67.69,31.24 67.69,29 IC1.45 | v74.55,18.16 IC3.20
  Bottom 0.406: v74.55,18.16 72.14,18.16 72.14,31.24 v68.71,31.24
AD7  (via drill 0.51)
  Top 0.406: v74.55,16.89 IC3.21 | IC2.9 v68.71,29.97 68.71,28.2 IC1.44
  Bottom 0.406: v74.55,16.89 71.25,16.89 71.25,29.97 v68.71,29.97
ALE
  Top 0.406: 64.7,27.43 IC1.43 77.69,27.4 78.99,28.7 IC2.11
GND  (via drill 0.46, 0.51)  (1 unrouted)
  Top 0.305: C15.- 22.35,15.75
  Top 0.406: U1.2 v19.43,15.62 22.23,15.62 C15.- | v6.22,27.05 U1.18 | U1.2 17.3,15.49 | v6.22,23.24 U1.21 U1.22 v6.22,21.97 | v12.95,12.19 12.95,15.62 U1.2
  Top 0.508: v19.43,27.05 U1.11 | v6.22,21.97 4.19,21.97 C9.2 | v6.22,27.05 4.7,27.05 3.81,27.94 3.11,27.94 C10.2 C8.2 | C11.2 12.89,12.26 v12.95,12.19 | C16.- 87.06,45.72 C19.2 82.3,48.51 v82.3,50.8 82.3,56.31 C17.- | v57.02,63.5 57.02,59.88 C22.2 | v28.4,28.57 29.29,29.46 5V_TO_3V3.13 | v74.45,15.67 76.64,15.67 IC3.22 | IC1.63 51.7,34.18 v50.83,35.05 | IC1.53 59.72,33.22 v59.72,34.72 | v92.18,4.19 IC3.2
  Bottom 0.305: 20.45,34.23 20.57,34.29
  Bottom 0.406: C14.2 12.95,10.54 v12.95,12.19 | 3V3_TO_5V.18 3V3_TO_5V.17
  Bottom 0.508: C14.2 C13.2 | 13.84,27.05 R8.1 | 13.84,27.05 v19.43,27.05 20.45,27.05 20.45,34.23 C7.2 | v6.22,27.05 U1.18 11.68,27.05 | 11.81,27.05 11.68,27.05 | 13.84,27.05 11.81,27.05 | v6.22,23.24 U1.21 9.78,23.24 10.41,22.61 13.84,22.61 13.84,27.05 | 11.68,27.05 C6.2 | v6.22,21.97 9.78,21.97 9.78,15.62 v19.43,15.62 | C12.2 11.68,26.92 11.81,27.05 | v82.3,50.8 82.3,49.66 85.72,49.66 85.72,47.5 D4.A 87.06,47.5 87.06,47.75 87.97,47.75 D3.A | STAB_3V3.1 62.74,59.33 R10.1 | SD.GND3 57.02,60.95 v57.02,63.5 | ISP.10 ISP.8 ISP.6 ISP.4 | STAB_5V.1 74.64,59.33 R9.1 | 3V3_TO_5V.22 28.4,27.56 v28.4,28.57 | C5.1 74.95,8.84 74.95,15.65 74.45,15.65 v74.45,15.67 | C3.2 56.74,24.92 54.28,24.92 C23.1 | v50.83,35.05 51.71,34.16 51.71,31.24 C21.1 | v59.72,34.72 58.61,34.72 C1.2 | C4.1 87.18,4.19 v92.18,4.19
  pour Bottom (isolate 0.381): 0.23,64.77 94.03,64.77 94.03,63.55 94.03,0.23 92.58,0.23 0.23,0.23 0.23,1.52
  pour Top (isolate 0.381): 0.3,64.77 23.16,64.77 23.16,59.21 27.58,59.21 27.58,55.32 27.58,53.95 41.99,53.95 45.19,60.73 45.19,64.77 94.03,64.77 94.03,0.23 90.07,0.23 0.23,0.23 0.23,2.13 0.23,64.77
MISO  (via drill 0.51 pad 0.41)
  Top 0.406: IC1.13 49.01,21.84 47.12,21.84 47.12,20.32 v43.94,20.32
  Bottom 0.406: 43.18,20.32 v43.94,20.32 | 43.18,20.32 43.18,13.59 39.24,9.65 EXCONN.8 | 3V3_TO_5V.8 43.18,21.21 43.18,20.32
MOSI  (via drill 0.51)
  Top 0.406: IC1.12 46.23,22.6 v46.23,21.34 44.32,21.34 43.81,21.84 5V_TO_3V3.6
  Bottom 0.406: EXCONN.12 46.23,11.3 v46.23,21.34
N$1  (via drill 0.51)
  Top 0.356: v61.47,5.71 55.75,5.71 55.75,17.54
  Top 0.406: 55.75,17.54 IC1.23
  Bottom 0.406: C4.2 Q1.2 76.33,11.3 76.33,5.71 v61.47,5.71
N$2  (via drill 0.51)
  Top 0.356: IC1.24 56.5,15.89 56.52,6.73 v60.58,6.73
  Bottom 0.406: Q1.1 71.25,9.27 C5.2 71.31,6.73 v60.58,6.73
N$3  (via drill 0.51)
  Top 0.305: v19.81,38.61 19.81,41.53 1.27,41.53 R7.2
  Bottom 0.406: X1.10 v19.8,38.61 v19.81,38.61
N$4  (via drill 0.51)
  Top 0.406: v11.68,32.89 11.68,34.54 L1.2 11.6,38.73 v3.17,38.73
  Bottom 0.406: 7.43,42.8 X1.1 | 7.43,42.8 R2.2 7.43,49.53 R3.2 | C6.1 v11.68,32.89 | 7.43,42.8 3.17,42.8 v3.17,38.73
N$5  (via drill 0.51)
  Top 0.406: v6.99,32.77 5.08,32.77 5.08,28.32 U1.17
  Bottom 0.406: R2.1 9.53,45.59 X1.2 9.53,36.07 6.99,36.07 v6.99,32.77
N$6  (via drill 0.51)
  Top 0.406: v6.22,29.59 U1.16
  Bottom 0.406: R3.1 11.56,49.53 X1.3 11.56,34.8 9.78,34.8 9.78,29.59 v6.22,29.59
N$7  (via drill 0.51)
  Top 0.406: U1.13 15.62,29.59 v15.62,37.34
  Bottom 0.406: R4.1 13.59,49.4 X1.4 13.59,37.34 v15.62,37.34
N$8  (via drill 0.51)
  Top 0.406: U1.12 13.59,28.32 13.59,38.73 v15.62,38.73
  Bottom 0.406: R5.1 15.62,45.59 X1.5 15.62,38.86 v15.62,38.73
N$9
  Bottom 0.406: R4.2 17.59,49.4 R5.2 17.65,45.59 X1.6 21.08,42.8 21.08,36.13 C7.1
N$10  (via drill 0.51)
  Top 0.406: v6.22,15.62 U1.27
  Bottom 0.406: R6.1 1.27,34.61 1.27,15.62 v6.22,15.62
N$11
  Top 0.406: R7.1 1.27,16.89 U1.26
N$12
  Bottom 0.508: R6.2 5.34,36.51 X1.7
N$16  (via drill 0.51)
  Top 0.406: v20.07,8.13 20.07,6.35 Q2.2 | v6.22,20.7 U1.23
  Bottom 0.406: v20.07,8.13 20.07,10.54 C13.1 16.06,14.35 8.4,14.35 8.4,20.7 v6.22,20.7
N$17  (via drill 0.51)
  Top 0.406: v5.71,8.13 5.71,6.6 8.13,6.6 Q2.1 | v6.22,19.43 U1.24
  Bottom 0.406: 7.24,10.54 5.71,10.54 v5.71,8.13 | 7.24,10.54 C14.1 | v6.22,19.43 7.24,19.43 7.24,10.54
N$20  (via drill 0.51)
  Top 0.406: 17.3,30.92 U1.14 v19.3,30.86
  Bottom 0.406: R8.2 13.84,30.86 v19.3,30.86
N$21
  Top 0.406: U1.1 17.3,12.06 22.23,12.06 C15.+
N$31
  Bottom 0.508: D1.A D3.C 92.06,47.43 X2.1
N$32  (via drill 0.51)
  Top 0.406: IC1.62 52.5,34.88 v52.32,35.05
  Bottom 0.406: v52.32,35.05 52.45,35.05 52.45,33.02 56.2,33.02 C21.2
N$33
  Bottom 0.508: X2.2 87.06,57.3 X2.3 87.06,52.06 81.24,52.06 D4.C D2.A
N$34  (via drill 0.51)
  Top 0.508: v83.95,53.34 83.95,50.8 88.96,50.8 C19.1 90.25,48.51 C16.+ 92.71,45.72 v92.71,40.51
  Bottom 0.508: D2.C D1.C 90.17,43.43 90.17,40.51 v92.71,40.51 | v83.95,53.34 80.37,53.34 80.37,63.88 76.99,63.88 STAB_5V.3
N$35  (via drill 0.51)
  Top 0.406: 50.93,33.2 IC1.64 50.9,33.61 v49.55,34.95
  Bottom 0.406: L2.2 56.98,28.96 52.45,28.96 52.45,27.3 C23.2 50.93,27.3 50.7,27.53 50.7,31.83 49.55,32.97 v49.55,34.95
N$36
  Bottom 0.508: R9.2 72.71,61.4 LED1.K
N$37
  Bottom 0.508: LED2.K 60.89,55.44 R10.2
PB5  (via drill 0.51)
  Top 0.406: IC1.15 50.42,20.2 50.42,19.05 49.91,18.54 49.91,12.95 52.32,12.95 v52.32,12.32
  Bottom 0.406: v52.32,12.32 52.32,9.96 50.52,8.15 48.13,8.13 EXCONN.13
PB6  (via drill 0.51)
  Top 0.406: IC1.16 49.1,11.99 v49.4,11.68
  Bottom 0.406: EXCONN.16 v49.4,11.68
PB7  (via drill 0.51)
  Top 0.406: IC1.17 50.9,13.97 v54.48,13.97
  Bottom 0.406: v54.48,13.97 54.48,10.92 50.42,6.86 EXCONN.15
PD4  (via drill 0.51)
  Top 0.406: IC1.29 60.5,14.18 v60.83,13.84
  Bottom 0.406: v60.83,13.84 60.83,10.67 57.91,10.67 50.93,3.68 42.29,3.68 39.24,6.73 EXCONN.7
PD5  (via drill 0.51)
  Top 0.406: IC1.30 61.3,15.67 v61.72,15.24
  Bottom 0.406: 59.56,9.91 arc90 59.44,9.91 | 59.56,9.91 61.85,9.91 61.85,15.24 v61.72,15.24 | 59.56,9.91 58.29,9.91 51.31,2.92 40.51,2.92 36.7,6.73 EXCONN.5
PD6  (via drill 0.51)
  Top 0.406: IC1.31 62.1,16.9 v62.87,16.13
  Bottom 0.406: v62.87,16.13 62.99,16 62.99,9.14 58.67,9.14 51.69,2.16 38.73,2.16 34.16,6.73 EXCONN.3
PD7  (via drill 0.51)
  Top 0.406: IC1.32 63.43,17.6 v64.26,16.76
  Bottom 0.406: v64.26,16.76 64.26,8.38 59.05,8.38 52.07,1.4 36.96,1.4 31.62,6.73 EXCONN.1
PDI  (via drill 0.51)
  Top 0.406: v44.45,33.27 44.45,30.61 IC1.2
  Top 0.508: IC1.2
  Bottom 0.406: ISP.1 72.39,52.58 48.01,52.58 43.56,48.13 43.56,33.27 v44.45,33.27
PDO  (via drill 0.51)
  Top 0.406: IC1.3 42.93,29.8 42.93,50.8 v57.28,50.8
  Bottom 0.406: v57.28,50.8 ISP.9
PE4  (via drill 0.51)
  Top 0.406: IC1.6 48.94,27.56 46.61,27.56 v46.23,27.18
  Bottom 0.406: v46.23,27.18 46.23,23.37 45.09,22.23 45.09,12.95 41.78,9.65 EXCONN.10
PE5  (via drill 0.51)
  Top 0.406: IC1.7 49.1,26.67 v47.5,26.67
  Bottom 0.406: v47.5,26.67 47.5,18.41 46.99,17.91 46.99,9.4 EXCONN.14
PF0  (via drill 0.51)
  Top 0.406: IC1.61 53.3,35.48 52.58,36.2 52.58,38.35 v52.96,38.73
  Bottom 0.406: v52.96,38.73 52.96,42.04 PORTF.7
PF1  (via drill 0.51)
  Top 0.406: IC1.60 54.1,38.1 v53.98,38.1
  Bottom 0.406: v53.98,38.1 53.98,40.51 PORTF.8
PF2  (via drill 0.51)
  Top 0.406: IC1.59 54.9,38.64 v55.12,38.86
  Bottom 0.406: v55.12,38.86 55.5,39.24 55.5,42.16 56.64,43.31 PORTF.5
PF3  (via drill 0.51)
  Top 0.406: IC1.58 55.7,38.04 v56.39,38.73
  Bottom 0.406: v56.39,38.73 56.77,39.12 PORTF.6
PF4  (via drill 0.51)
  Top 0.406: IC1.57 56.5,37.57 v57.78,38.86
  Bottom 0.406: v57.78,38.86 58.04,39.12 58.04,42.16 59.18,43.31 PORTF.3
PF5  (via drill 0.51)
  Top 0.406: IC1.56 57.3,36.98 v58.93,38.61
  Bottom 0.406: v58.93,38.61 59.31,38.99 PORTF.4
PF6  (via drill 0.51)
  Top 0.406: IC1.55 58.1,36.51 v60.33,38.73
  Bottom 0.406: v60.33,38.73 60.58,38.99 60.58,42.16 61.72,43.31 PORTF.1
PF7  (via drill 0.51)
  Top 0.406: IC1.54 58.9,36.04 v60.33,37.47
  Bottom 0.406: v60.33,37.47 61.85,37.47 PORTF.2
RD  (via drill 0.51)
  Top 0.406: IC3.24 72.64,13.08 v72.64,15.75 | v67.69,15.75 67.69,20.19 IC1.34
  Bottom 0.406: v67.69,15.75 v72.64,15.75
RST  (via drill 0.51)
  Top 0.406: IC1.20 53.3,16.05 arc90 v53.34,16
  Bottom 0.406: v53.34,16 R1.1 C3.1 | ISP.5 70.36,49.53 76.45,49.53 76.45,42.67 64.26,42.67 64.26,32.77 62.74,31.24 62.74,24.26
  Bottom 0.508: R1.1 53.34,20.83 | 62.74,24.26 58.65,24.26 58.65,20.78 56.74,20.78 C3.1
RXD  (via drill 0.51)
  Top 0.356: 58.93,7.75 58.93,16.38
  Top 0.406: 58.9,16.38 IC1.27 | 58.9,16.38 58.9,16.03 | v58.29,4.7 58.42,4.57 61.72,4.57 62.61,5.46 62.61,7.75 58.93,7.75 | 58.93,16.38 58.9,16.38
  Bottom 0.406: TTY.2 v58.29,4.7
SCK  (via drill 0.51)
  Top 0.406: 49.66,23.4 IC1.11 | 49.66,23.4 50.67,23.4 50.67,31.88 48.08,34.47 48.08,48.77 v57.4,48.77 | v38.61,13.59 38.61,23.11 5V_TO_3V3.7 42.8,23.11 43.05,23.37 49.62,23.37 49.66,23.4
  Bottom 0.406: ISP.7 65.28,49.53 58.17,49.53 v57.4,48.77 | v38.61,13.59 38.61,11.3 EXCONN.6
SCL  (via drill 0.51)
  Top 0.406: IC1.25 57.3,14.37 v57.28,14.35
  Bottom 0.406: v57.28,14.35 57.28,12.45 50.04,5.21 45.97,5.21 EXCONN.11
SD3V3_DET
  Bottom 0.406: 3V3_TO_5V.20 23.46,25.02 SD.CD
SD3V3_WP
  Bottom 0.406: SD.WRITE_PROTECT 23.48,56.75 21.97,55.5 21.97,37.87 24.99,34.85 24.99,26.29 3V3_TO_5V.21
SD_DET  (via drill 0.51 pad 0.41)
  Top 0.406: IC1.8 45.57,25.8 v45.09,26.29
  Bottom 0.406: 3V3_TO_5V.4 v45.09,26.29
SD_WP  (via drill 0.51 pad 0.41)
  Top 0.406: IC1.4 42.67,29 v42.67,27.56
  Bottom 0.406: 3V3_TO_5V.3 v42.67,27.56
SDA  (via drill 0.51)
  Top 0.356: v58.17,12.19 58.17,17.53
  Top 0.406: 58.17,17.53 IC1.26
  Bottom 0.406: v58.17,12.19 50.42,4.45 44.2,4.45 EXCONN.9
TXD  (via drill 0.51)
  Top 0.406: IC1.28 59.69,8.51 63.37,8.51 v63.37,4.7
  Bottom 0.406: TTY.3 60.83,4.7 v63.37,4.7
VCC  (via drill 0.51)
  Top 0.406: IC1.21 54.1,16.64 54.36,16.38 v54.36,15.37
  Top 0.508: v74.93,64.01 74.93,61.4 C20.1 78.23,61.4 | C17.+ 80.77,61.4 78.23,61.4 | 78.74,5.46 78.74,2.92 IC3.32 73.3,2.92 v73.13,3.1 | 78.23,61.4 78.23,43.94 v74.17,43.94 74.17,40.13 IC2.20 89.66,40.13 v89.66,34.92 | v48.01,16.76 5V_TO_3V3.2 5V_TO_3V3.1 40.97,11.94 v36.07,11.94 | 78.74,5.46 IC3.30 | v78.74,24 78.74,5.46 | IC1.52 60.6,33.2 60.6,36.35 v61.39,36.35
  Bottom 0.406: 60.45,31.37 C1.1 | v54.36,15.37 54.36,19.18 60.48,19.23 C2.1
  Bottom 0.508: STAB_5V.2 74.93,61.62 v74.93,64.01 LED1.A | LED1.A 72.64,63.91 | 51.69,37.21 PORTF.10 | 51.69,37.21 59.18,37.21 59.18,36.35 v61.39,36.35 | ISP.2 v74.17,43.94 63.25,43.94 63.22,36.35 v61.39,36.35 | 51.69,37.21 47.98,37.24 47.32,36.58 47.32,30.1 | 47.32,30.1 49.4,30.1 49.4,22.67 | 47.32,30.1 3V3_TO_5V.1 | v78.74,24 89.66,24 v89.66,34.92 | v48.01,16.76 49.4,16.76 | v36.07,11.94 34.16,10.03 EXCONN.4 | STAB_3V3.3 62.51,64.39 72.26,64.39 LED1.A | TTY.4 64.06,3.1 v73.13,3.1 | 49.4,16.76 51.92,16.76 51.92,14.88 53.87,14.88 v54.36,15.37 | 49.4,22.67 R1.2 | 49.4,16.76 49.4,22.67 | L2.1 60.88,31.24 C1.1 | 60.45,31.37 61.39,31.37 v61.39,36.35
WR
  Top 0.406: IC1.33 66.8,19.4 66.8,6.73 IC3.29